# Altium schematic sheet AD9854_V2.1.SchDoc
size A2
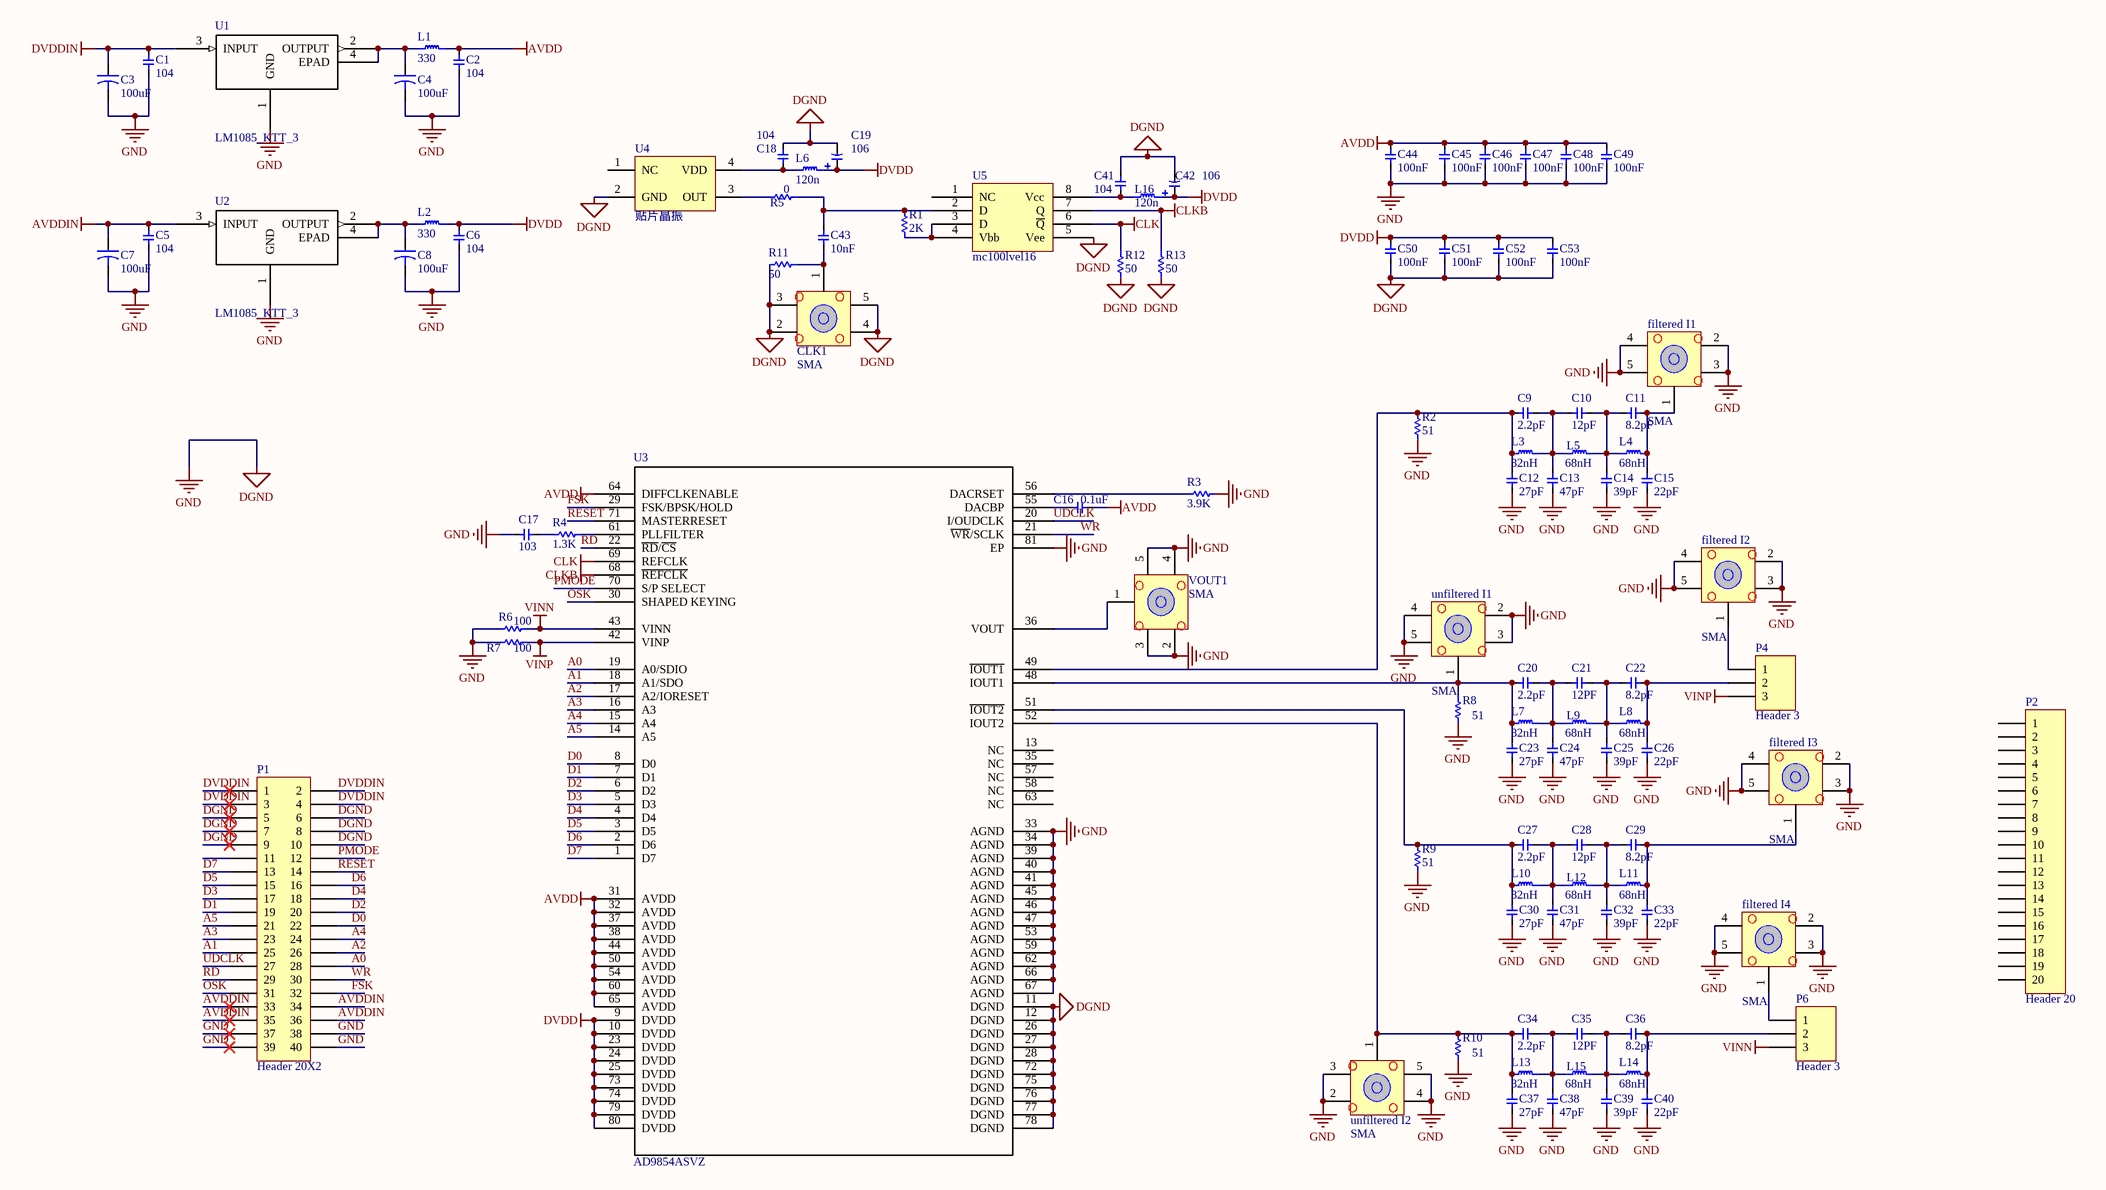
[diagram p0: AD9854_V2.1.SchDoc]

## Parts
C1  value 104  [0805]  (hidden comment: Cap)
C2  value 104  [0805]  (hidden comment: Cap)
C3  value 100uF  [CAPR5-4X5]  (hidden comment: Cap2)
C4  value 100uF  [CAPR5-4X5]  (hidden comment: Cap2)
C5  value 104  [0805]  (hidden comment: Cap)
C6  value 104  [0805]  (hidden comment: Cap)
C7  value 100uF  [CAPR5-4X5]  (hidden comment: Cap2)
C8  value 100uF  [CAPR5-4X5]  (hidden comment: Cap2)
C9  value 2.2pF  [0805]  (hidden comment: Cap)
C10  value 12pF  [0805]  (hidden comment: Cap)
C11  value 8.2pF  [0805]  (hidden comment: Cap)
C12  value 27pF  [0805]  (hidden comment: Cap)
C13  value 47pF  [0805]  (hidden comment: Cap)
C14  value 39pF  [0805]  (hidden comment: Cap)
C15  value 22pF  [0805]  (hidden comment: Cap)
C16  value 0.1uF  [0805]  (hidden comment: Cap)
C17  value 103  [0805]  (hidden comment: Cap)
C18  value 104  [0805]  (hidden comment: Cap)
C19  value 106  [c1206 - duplicate]  (hidden comment: Cap Pol)
C20  value 2.2pF  [0805]  (hidden comment: Cap)
C21  value 12PF  [0805]  (hidden comment: Cap)
C22  value 8.2pF  [0805]  (hidden comment: Cap)
C23  value 27pF  [0805]  (hidden comment: Cap)
C24  value 47pF  [0805]  (hidden comment: Cap)
C25  value 39pF  [0805]  (hidden comment: Cap)
C26  value 22pF  [0805]  (hidden comment: Cap)
C27  value 2.2pF  [0805]  (hidden comment: Cap)
C28  value 12pF  [0805]  (hidden comment: Cap)
C29  value 8.2pF  [0805]  (hidden comment: Cap)
C30  value 27pF  [0805]  (hidden comment: Cap)
C31  value 47pF  [0805]  (hidden comment: Cap)
C32  value 39pF  [0805]  (hidden comment: Cap)
C33  value 22pF  [0805]  (hidden comment: Cap)
C34  value 2.2pF  [0805]  (hidden comment: Cap)
C35  value 12PF  [0805]  (hidden comment: Cap)
C36  value 8.2pF  [0805]  (hidden comment: Cap)
C37  value 27pF  [0805]  (hidden comment: Cap)
C38  value 47pF  [0805]  (hidden comment: Cap)
C39  value 39pF  [0805]  (hidden comment: Cap)
C40  value 22pF  [0805]  (hidden comment: Cap)
C41  value 104  [0805]  (hidden comment: Cap)
C42  value 106  [c1206 - duplicate]  (hidden comment: Cap Pol)
C43  value 10nF  [0805]  (hidden comment: Cap)
C44  value 100nF  [0805]  (hidden comment: Cap)
C45  value 100nF  [0805]  (hidden comment: Cap)
C46  value 100nF  [0805]  (hidden comment: Cap)
C47  value 100nF  [0805]  (hidden comment: Cap)
C48  value 100nF  [0805]  (hidden comment: Cap)
C49  value 100nF  [0805]  (hidden comment: Cap)
C50  value 100nF  [0805]  (hidden comment: Cap)
C51  value 100nF  [0805]  (hidden comment: Cap)
C52  value 100nF  [0805]  (hidden comment: Cap)
C53  value 100nF  [0805]  (hidden comment: Cap)
CLK1  SMA  [SMA]
filtered_I1  SMA  [SMA]
filtered_I2  SMA  [SMA]
filtered_I3  SMA  [SMA]
filtered_I4  SMA  [SMA]
L1  value 330  [INDP6055X45N]  (hidden comment: ind)
L2  value 330  [INDP6055X45N]  (hidden comment: ind)
L3  value 82nH  [0805]  (hidden comment: ind)
L4  value 68nH  [0805]  (hidden comment: ind)
L5  value 68nH  [0805]  (hidden comment: ind)
L6  value 120n  [0805]  (hidden comment: ind)
L7  value 82nH  [0805]  (hidden comment: ind)
L8  value 68nH  [0805]  (hidden comment: ind)
L9  value 68nH  [0805]  (hidden comment: ind)
L10  value 82nH  [0805]  (hidden comment: ind)
L11  value 68nH  [0805]  (hidden comment: ind)
L12  value 68nH  [0805]  (hidden comment: ind)
L13  value 82nH  [0805]  (hidden comment: ind)
L14  value 68nH  [0805]  (hidden comment: ind)
L15  value 68nH  [0805]  (hidden comment: ind)
L16  value 120n  [0805]  (hidden comment: ind)
P1  Header 20X2  [HDR2X20]
P2  Header 20  [HDR1X20]
P4  Header 3  [HDR1X3]
P6  Header 3  [HDR1X3]
R1  value 2K  [0805]  (hidden comment: Res)
R2  value 51  [0805]  (hidden comment: Res)
R3  value 3.9K  [0805]  (hidden comment: Res)
R4  value 1.3K  [0805]  (hidden comment: Res)
R5  value 0  [0805]  (hidden comment: Res)
R6  value 100  [0805]  (hidden comment: Res)
R7  value 100  [0805]  (hidden comment: Res)
R8  value 51  [0805]  (hidden comment: Res)
R9  value 51  [0805]  (hidden comment: Res)
R10  value 51  [0805]  (hidden comment: Res)
R11  value 50  [0805]  (hidden comment: Res)
R12  value 50  [0805]  (hidden comment: Res)
R13  value 50  [0805]  (hidden comment: Res)
U1  LM1085_KTT_3  [KTT3-M]
U2  LM1085_KTT_3  [KTT3-M]
U3  AD9854ASVZ  [SV_80_4-M]
U4  贴片晶振  [贴片晶振]
U5  mc100lvel16  [D8]
unfiltered_I1  SMA  [SMA]
unfiltered_I2  SMA  [SMA]
VOUT1  SMA  [SMA]

## Nets
AVDD: C2.1 C16.2 C44.2 C45.2 C46.2 C47.2 C48.2 C49.2 L1.2 U3.31(AVDD) U3.32(AVDD) U3.37(AVDD) U3.38(AVDD) U3.44(AVDD) U3.50(AVDD) U3.54(AVDD) U3.60(AVDD) U3.64(DIFFCLKENABLE) U3.65(AVDD)
AVDDIN: C5.1 C7.1 P1.33 P1.34 P1.35 P1.36 U2.3(INPUT)
CLK: R12.2 U3.69(REFCLK) U5.6(~{Q})
CLKB: R13.2 U3.68(~{REFCLK}) U5.7(Q)
DGND: C1.2 C2.2 C3.2 C4.2 C5.2 C6.2 C7.2 C8.2 C12.1 C13.1 C14.1 C15.1 C17.2 C18.2 C19.2 C23.1 C24.1 C25.1 C26.1 C30.1 C31.1 C32.1 C33.1 C37.1 C38.1 C39.1 C40.1 C41.1 C42.2 C44.1 C45.1 C46.1 C47.1 C48.1 C49.1 C50.1 C51.1 C52.1 C53.1 CLK1.2 CLK1.3 CLK1.4 CLK1.5 filtered_I1.2 filtered_I1.3 filtered_I1.4 filtered_I1.5 filtered_I2.2 filtered_I2.3 filtered_I2.4 filtered_I2.5 filtered_I3.2 filtered_I3.3 filtered_I3.4 filtered_I3.5 filtered_I4.2 filtered_I4.3 filtered_I4.4 filtered_I4.5 P1.5 P1.6 P1.7 P1.8 P1.9 P1.10 P1.37 P1.38 P1.39 P1.40 R2.1 R3.2 R6.1 R7.1 R8.1 R9.1 R10.1 R11.1 R12.1 R13.1 U1.1(GND) U2.1(GND) U3.11(DGND) U3.12(DGND) U3.26(DGND) U3.27(DGND) U3.28(DGND) U3.33(AGND) U3.34(AGND) U3.39(AGND) U3.40(AGND) U3.41(AGND) U3.45(AGND) U3.46(AGND) U3.47(AGND) U3.53(AGND) U3.59(AGND) U3.62(AGND) U3.66(AGND) U3.67(AGND) U3.72(DGND) U3.75(DGND) U3.76(DGND) U3.77(DGND) U3.78(DGND) U3.81(EP) U4.2(GND) U5.5(Vee) unfiltered_I1.2 unfiltered_I1.3 unfiltered_I1.4 unfiltered_I1.5 unfiltered_I2.2 unfiltered_I2.3 unfiltered_I2.4 unfiltered_I2.5 VOUT1.2 VOUT1.3 VOUT1.4 VOUT1.5  [also labelled GND]
DVDD: C6.1 C19.1 C42.1 C50.2 C51.2 C52.2 C53.2 L2.2 L6.2 L16.2 U3.9(DVDD) U3.10(DVDD) U3.23(DVDD) U3.24(DVDD) U3.25(DVDD) U3.73(DVDD) U3.74(DVDD) U3.79(DVDD) U3.80(DVDD)
DVDDIN: C1.1 C3.1 P1.1 P1.2 P1.3 P1.4 U1.3(INPUT)
VINN: P6.3 R6.2 U3.43(VINN)
VINP: P4.3 R7.2 U3.42(VINP)
A0: P1.28 U3.19(A0/SDIO)
A1: P1.25 U3.18(A1/SDO)
A2: P1.26 U3.17(A2/IORESET)
A3: P1.23 U3.16(A3)
A4: P1.24 U3.15(A4)
A5: P1.21 U3.14(A5)
D0: P1.22 U3.8(D0)
D1: P1.19 U3.7(D1)
D2: P1.20 U3.6(D2)
D3: P1.17 U3.5(D3)
D4: P1.18 U3.4(D4)
D5: P1.15 U3.3(D5)
D6: P1.16 U3.2(D6)
D7: P1.13 U3.1(D7)
FSK: P1.32 U3.29(FSK/BPSK/HOLD)
OSK: P1.31 U3.30(SHAPED_KEYING)
PMODE: P1.12 U3.70(S/P_SELECT)
RD: P1.29 U3.22(~{RD}/~{CS})
RESET: P1.14 U3.71(MASTERRESET)
UDCLK: P1.27 U3.20(I/OUDCLK)
WR: P1.30 U3.21(~{WR}/SCLK)
NetC4_1: C4.1 L1.1 U1.2(OUTPUT) U1.4(EPAD)
NetC8_1: C8.1 L2.1 U2.2(OUTPUT) U2.4(EPAD)
NetC9_1: C9.1 C12.2 L3.1 R2.2 U3.49(~{IOUT1})
NetC9_2: C9.2 C10.1 C13.2 L3.2 L5.1
NetC10_2: C10.2 C11.1 C14.2 L4.1 L5.2
NetC11_2: C11.2 C15.2 filtered_I1.1 L4.2
NetC16_1: C16.1 U3.55(DACBP)
NetC17_1: C17.1 R4.2
NetC18_1: C18.1 L6.1 U4.4(VDD)
NetC20_1: C20.1 C23.2 L7.1 R8.2 U3.48(IOUT1) unfiltered_I1.1
NetC20_2: C20.2 C21.1 C24.2 L7.2 L9.1
NetC21_2: C21.2 C22.1 C25.2 L8.1 L9.2
NetC22_2: C22.2 C26.2 L8.2 P4.2
NetC27_1: C27.1 C30.2 L10.1 R9.2 U3.51(~{IOUT2})
NetC27_2: C27.2 C28.1 C31.2 L10.2 L12.1
NetC28_2: C28.2 C29.1 C32.2 L11.1 L12.2
NetC29_2: C29.2 C33.2 filtered_I3.1 L11.2
NetC34_1: C34.1 C37.2 L13.1 R10.2 U3.52(IOUT2) unfiltered_I2.1
NetC34_2: C34.2 C35.1 C38.2 L13.2 L15.1
NetC35_2: C35.2 C36.1 C39.2 L14.1 L15.2
NetC36_2: C36.2 C40.2 L14.2 P6.2
NetC41_2: C41.2 L16.1 U5.8(Vcc)
NetC43_1: C43.1 CLK1.1 R11.2
NetC43_2: C43.2 R1.1 R5.2 U5.2(D)
Netfiltered_I2_1: filtered_I2.1 P4.1
Netfiltered_I4_1: filtered_I4.1 P6.1
NetR1_2: R1.2 U5.3(D) U5.4(Vbb)
NetR3_1: R3.1 U3.56(DACRSET)
NetR4_1: R4.1 U3.61(PLLFILTER)
NetR5_1: R5.1 U4.3(OUT)
NetU3_36: U3.36(VOUT) VOUT1.1

Not connected (* = marked no-connect by the designer): P1 11; P2 1 2 3 4 5 6 7 8 9 10 11 12 13 14 15 16 17 18 19 20; U3 13(NC) 35(NC) 57(NC) 58(NC) 63(NC); U4 1(NC); U5 1(NC)

## Library data of the parts
C1 C2 C5 C6 C9-C18 C20-C41 C43-C53 = Cap: Capacitor; Published: 8-Jun-2000; LatestRevisionDate: 17-Jul-2002; LatestRevisionNote: Re-released for DXP Platform.; PackageReference: RAD-0.3; Publisher: Altium Limited; PackageDescription: Radial Cap, Thru-Hole; 2 Leads; 0.3 in Pin Spacing
C3 C4 C7 C8 = Cap2: Capacitor; Published: 23-Sep-2002; PackageReference: CAPR5-4X5; Publisher: Altium Limited; PackageDescription: Capacitor; 2 Leads
C19 C42 = Cap Pol: Polarized Capacitor (Axial); Published: 8-Jun-2000; LatestRevisionDate: 17-Jul-2002; LatestRevisionNote: Re-released for DXP Platform.; PackageReference: POLAR0.8; Publisher: Altium Limited; PackageDescription: Polarized Capacitor; 2 Leads
L1-L16 = ind: Resistor; Published: 8-Jun-2000; LatestRevisionDate: 17-Jul-2002; LatestRevisionNote: Re-released for DXP Platform.; PackageReference: AXIAL-0.3; Publisher: Altium Limited; PackageDescription: Axial Device, Thru-Hole; 2 Leads; 0.3 in Pin Spacing
P1 = Header 20X2: Header, 20-Pin, Dual row; LatestRevisionDate: 17-Jul-2002; LatestRevisionNote: Re-released for DXP Platform.; Publisher: Altium Limited
P2 = Header 20: Header, 20-Pin; LatestRevisionDate: 17-Jul-2002; LatestRevisionNote: Re-released for DXP Platform.; Publisher: Altium Limited
P4 P6 = Header 3: Header, 3-Pin; LatestRevisionDate: 17-Jul-2002; LatestRevisionNote: Re-released for DXP Platform.; Publisher: Altium Limited
R1-R13 = Res: Resistor; Published: 8-Jun-2000; LatestRevisionDate: 17-Jul-2002; LatestRevisionNote: Re-released for DXP Platform.; PackageReference: AXIAL-0.3; Publisher: Altium Limited; PackageDescription: Axial Device, Thru-Hole; 2 Leads; 0.3 in Pin Spacing
U1 U2 = LM1085_KTT_3: Imported; Vendor: Texas Instruments; Manufacturer_Part_Number: lm1085_ktt_3; RefDes: RefDes; Type: Type; Value: Value
U3 = AD9854ASVZ: Imported; Manufacturer_Part_Number: AD9854ASVZ; Vendor: Vendor; RefDes: RefDes; Type: DEV; Value: Value